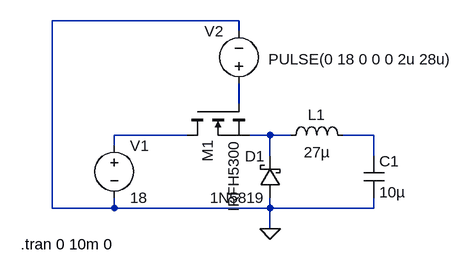
[diagram p0: schematic buck_converter.asc]
buck_converter.asc, the LTspice schematic file:
Version 4
SHEET 1 880 680
WIRE 128 -32 -160 -32
WIRE 128 -16 128 -32
WIRE 128 96 128 64
WIRE 48 144 -64 144
WIRE 176 144 144 144
WIRE 208 144 176 144
WIRE 336 144 288 144
WIRE -64 160 -64 144
WIRE 176 176 176 144
WIRE 336 176 336 144
WIRE -160 256 -160 -32
WIRE -64 256 -64 240
WIRE -64 256 -160 256
WIRE 176 256 176 240
WIRE 176 256 -64 256
WIRE 336 256 336 240
WIRE 336 256 176 256
WIRE 176 288 176 256
FLAG 176 288 0
SYMBOL ind 192 160 R270
WINDOW 0 32 56 VTop 2
WINDOW 3 5 56 VBottom 2
SYMATTR InstName L1
SYMATTR Value 27µ
SYMATTR SpiceLine Ipk=1 Rser=0.061 Rpar=0 Cpar=0
SYMBOL schottky 192 240 R180
WINDOW 0 24 64 Left 2
WINDOW 3 24 0 Left 2
SYMATTR InstName D1
SYMATTR Value 1N5819
SYMATTR Description Diode
SYMATTR Type diode
SYMBOL nmos 48 96 M90
SYMATTR InstName M1
SYMATTR Value IRFH5300
SYMBOL voltage -64 144 R0
WINDOW 123 0 0 Left 2
WINDOW 39 0 0 Left 2
SYMATTR InstName V1
SYMATTR Value 18
SYMBOL voltage 128 80 R180
WINDOW 0 24 96 Left 2
WINDOW 3 -329 53 Left 2
WINDOW 123 0 0 Left 2
WINDOW 39 0 0 Left 2
SYMATTR InstName V2
SYMATTR Value PULSE(0 18 0 0 0 2u 28u)
SYMBOL cap 320 176 R0
SYMATTR InstName C1
SYMATTR Value 10µ
SYMATTR SpiceLine V=16 Irms=7.16 Rser=0.00732742 Lser=0 mfg="KEMET" pn="C1206C106K4PAC" type="X5R"
TEXT -208 312 Left 2 !.tran 0 10m 0

The netlist it stands for:
* buck_converter.asc
L1 N003 N004 27µ Ipk=1 Rser=0.061 Rpar=0 Cpar=0
D1 0 N003 1N5819
M1 N002 N001 N003 N003 IRFH5300
V1 N002 0 18
V2 N001 0 PULSE(0 18 0 0 0 2u 28u)
C1 N004 0 10µ V=16 Irms=7.16 Rser=0.00732742 Lser=0 mfg="KEMET" pn="C1206C106K4PAC" type="X5R"
.model D D
.lib standard.dio
.model NMOS NMOS
.model PMOS PMOS
.lib standard.mos
.tran 0 10m 0
.backanno
.end